# Altium schematic sheet 03_DAC.SchDoc: Digital-to-Analog Converter
size A4; SheetNumber: 1; SheetTotal: 3; PageSetup: Record=PageOptions|CenterHorizontal=True|CenterVertical=True|PrintScale=1.09|XCorrection=1.00|YCorrection=1.00|PrintKind=0|BorderSize=5000000|LeftOffset=0|BottomOffset=0|Orientation=2|PaperLength=1000|PaperWidth=1000|Scale=100|PaperSource=7|PrintQuality=-3|MediaType=1|DitherType=10|PrintScaleMode=1|PaperKind=A4|PaperIndex=9; SK_ProjectName: Analog Resource Monitor; Version: R01
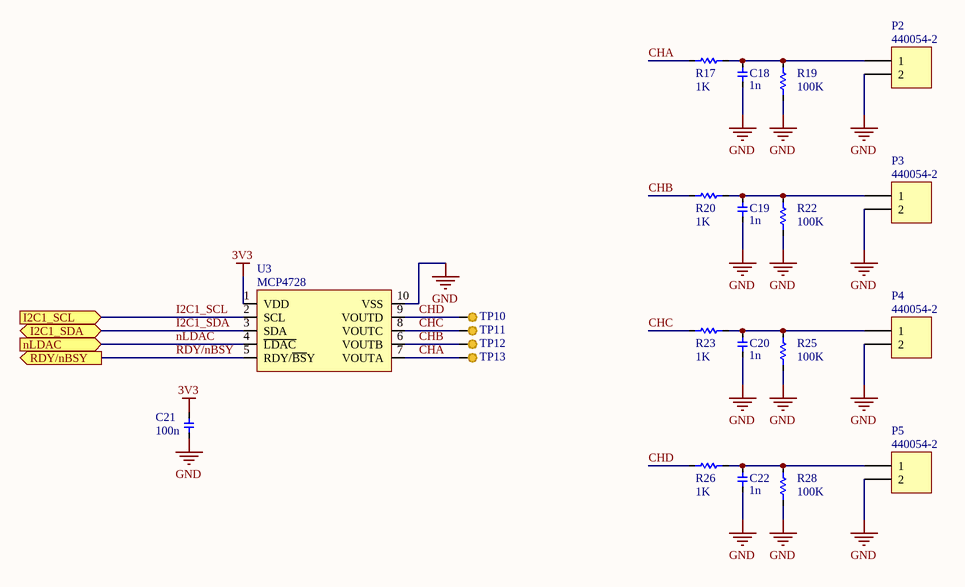
[diagram p0: 03_DAC.SchDoc]

## Parts
C18  value 1n  [0603 - CAP]  (hidden comment: Cap)
C19  value 1n  [0603 - CAP]  (hidden comment: Cap)
C20  value 1n  [0603 - CAP]  (hidden comment: Cap)
C21  value 100n  [0603 - CAP]  (hidden comment: Cap)
C22  value 1n  [0603 - CAP]  (hidden comment: Cap)
P2  440054-2  [HEADER-2mm-2Pos]
P3  440054-2  [HEADER-2mm-2Pos]
P4  440054-2  [HEADER-2mm-2Pos]
P5  440054-2  [HEADER-2mm-2Pos]
R17  value 1K  [0603]  (hidden comment: Res)
R19  value 100K  [0603]  (hidden comment: Res)
R20  value 1K  [0603]  (hidden comment: Res)
R22  value 100K  [0603]  (hidden comment: Res)
R23  value 1K  [0603]  (hidden comment: Res)
R25  value 100K  [0603]  (hidden comment: Res)
R26  value 1K  [0603]  (hidden comment: Res)
R28  value 100K  [0603]  (hidden comment: Res)
TP10  Test Point 0.6mm  [TP_SMD_1mm]  (value not drawn)  (no BOM)
TP11  Test Point 0.6mm  [TP_SMD_1mm]  (value not drawn)  (no BOM)
TP12  Test Point 0.6mm  [TP_SMD_1mm]  (value not drawn)  (no BOM)
TP13  Test Point 0.6mm  [TP_SMD_1mm]  (value not drawn)  (no BOM)
U3  MCP4728  [TSSOP50P490X110-10N]

## Ports
I2C1_SCL (in), I2C1_SDA (bidir), nLDAC (in), RDY/nBSY (out)

## Nets
3V3: C21.2 U3.1(VDD)
GND: C18.1 C19.1 C20.1 C21.1 C22.1 P2.2 P3.2 P4.2 P5.2 R19.1 R22.1 R25.1 R28.1 U3.10(VSS)
CHA: R17.1 TP13.1 U3.7(VOUTA)
CHB: R20.1 TP12.1 U3.6(VOUTB)
CHC: R23.1 TP11.1 U3.8(VOUTC)
CHD: R26.1 TP10.1 U3.9(VOUTD)
I2C1_SCL: U3.2(SCL) ; port I2C1_SCL
I2C1_SDA: U3.3(SDA) ; port I2C1_SDA
nLDAC: U3.4(~{LDAC}) ; port nLDAC
RDY/nBSY: U3.5(RDY/~{BS}Y) ; port RDY/nBSY
NetC18_2: C18.2 P2.1 R17.2 R19.2
NetC19_2: C19.2 P3.1 R20.2 R22.2
NetC20_2: C20.2 P4.1 R23.2 R25.2
NetC22_2: C22.2 P5.1 R26.2 R28.2

## Notes on the sheet
- Title:
- Project:
- Version:
- sasakaranovic.com
- Sasa Karanovic
- Project available at
- Date:
- Time:
- Sheet
- of

## Library data of the parts
C18-C20 C22 = Cap: Capacitor; Distributor: DigiKey
C21 = Cap: Capacitor; Manufacturer: AVX Corporation; Manufacturer Part Number: 06035C104KAT2A; Distributor Part Number: 478-5052-1-ND; Distributor: DigiKey
P2-P5 = 440054-2: CONN HEADER VERT 2POS 2MM; Manufacturer: TE Connectivity AMP Connectors; Manufacturer Part Number: 440054-2; Distributor: DigiKey
R17 R20 R23 R26 = Res: Resistor; Distributor: DigiKey
R19 R22 R25 R28 = Res: Resistor; Manufacturer: Yageo; Manufacturer Part Number: RC0603FR-07100KL; Distributor: DigiKey; Distributor Part Number: 311-100KHRCT-ND
TP10-TP13 = TP
U3 = MCP4728: IC DAC 12BIT W/I2C 10-MSOP; Manufacturer: Microchip Technology; Manufacturer Part Number: MCP4728T-E/UN; Distributor: DigiKey; Distributor Part Number: MCP4728T-E/UNCT-ND